# EAGLE design kitchen-timer (EAGLE 7.4.0)
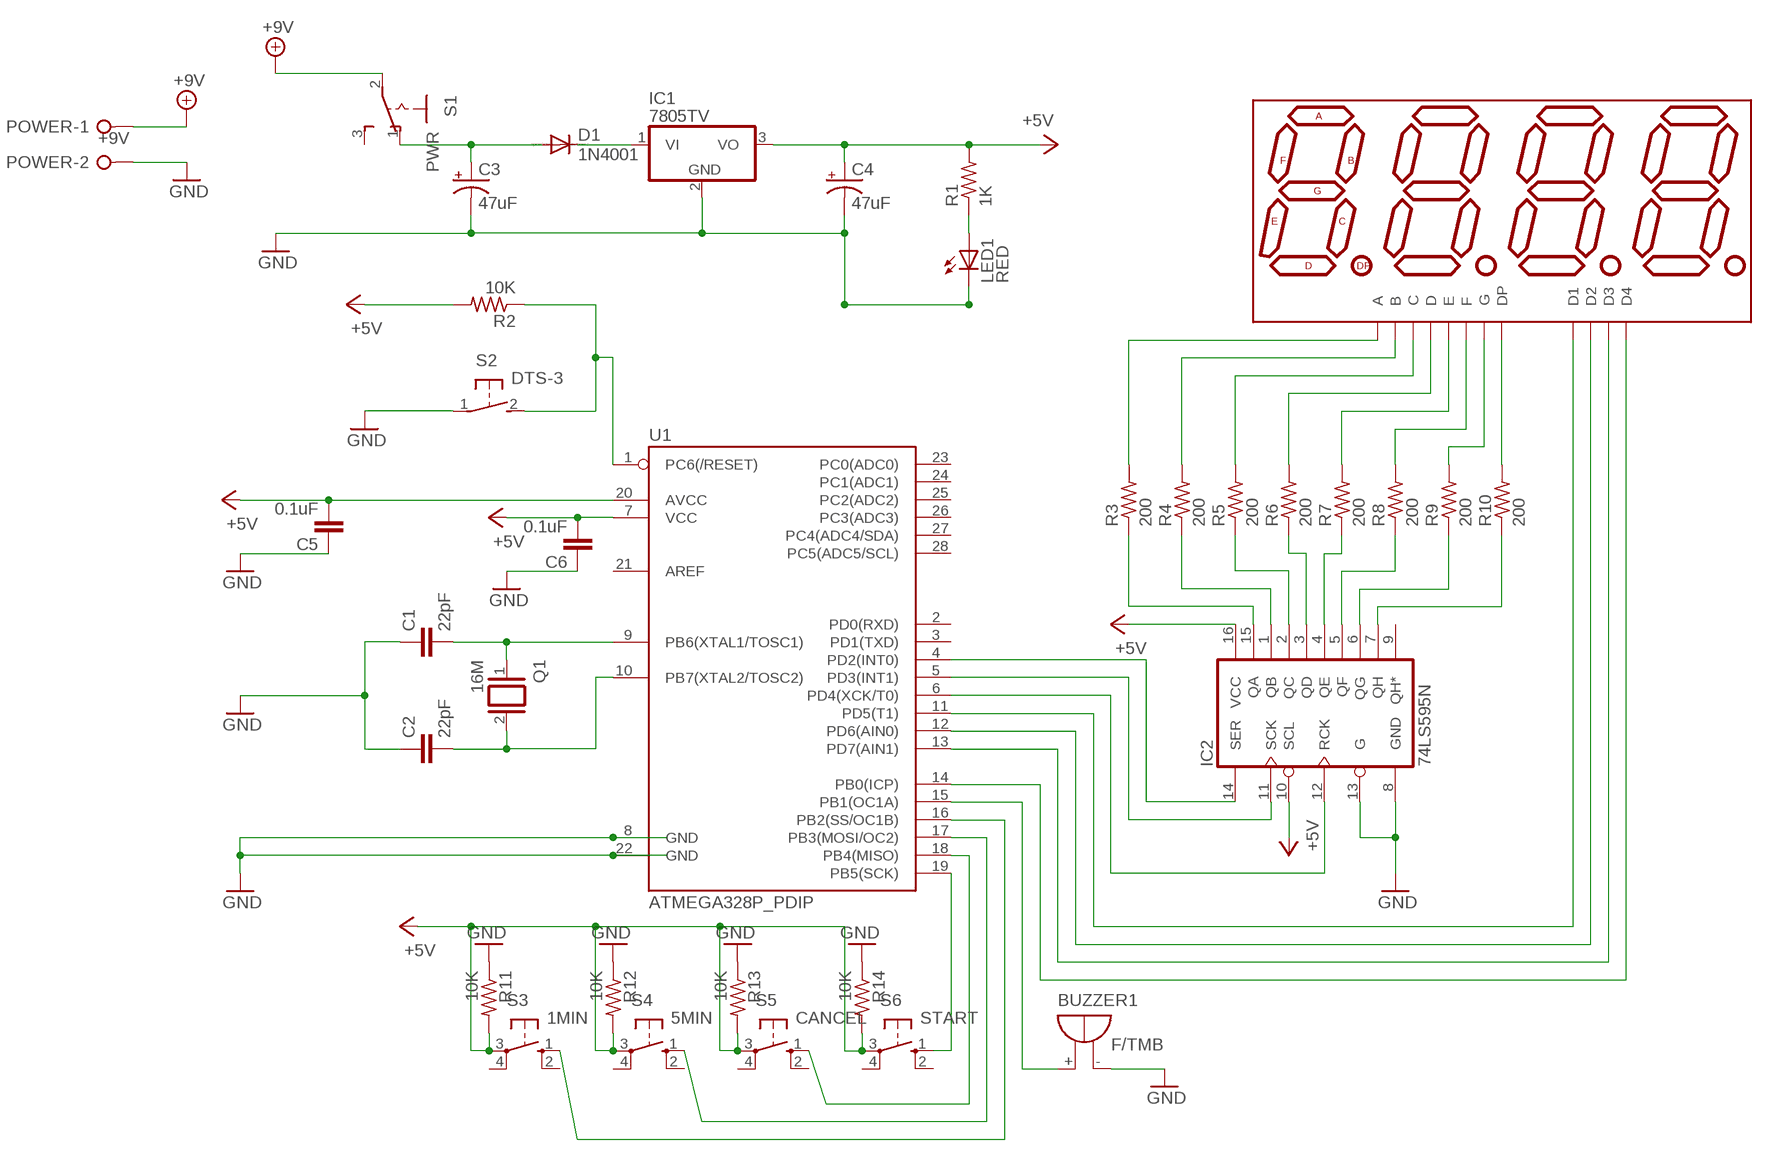
[diagram p0: schematic, sheet 1]

## Parts
BUZZER1  F/TMB  [F/TMB]
C1  22pF  C-EU025-025X050  [C025-025X050]
C2  22pF  C-EU025-025X050  [C025-025X050]
C3  47uF  CPOL-USE2,5-6E  [E2,5-6E]
C4  47uF  CPOL-USE2,5-6E  [E2,5-6E]
C5  0.1uF  C-EU025-025X050  [C025-025X050]
C6  0.1uF  C-EU025-025X050  [C025-025X050]
D1  1N4001  DIODE-D-7.5  [D-7.5]
DISP1  7-SEGMENT-4DIGIT-COUNTER-HP-BUBBLE  [DIL12]
IC1  7805TV  [TO220V]
IC2  74LS595N  [DIL16]
LED1  RED  LED5MM  [LED5MM]
POWER  +9V  W237-02P  [W237-132]
Q1  16M  XTAL/S  [QS]
R1  1K  R-US_0204/7  [0204/7]
R2  10K  R-US_0204/7  [0204/7]
R3  200  R-US_0204/7  [0204/7]
R4  200  R-US_0204/7  [0204/7]
R5  200  R-US_0204/7  [0204/7]
R6  200  R-US_0204/7  [0204/7]
R7  200  R-US_0204/7  [0204/7]
R8  200  R-US_0204/7  [0204/7]
R9  200  R-US_0204/7  [0204/7]
R10  200  R-US_0204/7  [0204/7]
R11  10K  R-US_0204/7  [0204/7]
R12  10K  R-US_0204/7  [0204/7]
R13  10K  R-US_0204/7  [0204/7]
R14  10K  R-US_0204/7  [0204/7]
S1  PWR  255SB  [255SB]
S2  DTS-3  [DTS-3]
S3  1MIN  10-XX  [B3F-10XX]
S4  5MIN  10-XX  [B3F-10XX]
S5  CANCEL  10-XX  [B3F-10XX]
S6  START  10-XX  [B3F-10XX]
U1  ATMEGA328P_PDIP  [DIL28-3]

## Nets
+5V [5v]: C4.+ C5.2 C6.2 IC1.3(VO) IC2.10(SCL) IC2.16(VCC) R1.2 R2.2 R11.2 R12.2 R13.2 R14.2 S3.3(P) S4.3(P) S5.3(P) S6.3(P) U1.7(VCC) U1.20(AVCC)
+9V: POWER.1 S1.2(P)
GND [gnd]: BUZZER1.- C1.1 C2.1 C3.- C4.- C5.1 C6.1 IC1.2(GND) IC2.8(GND) IC2.13(G) LED1.K(C) POWER.2 R11.1 R12.1 R13.1 R14.1 S2.1 U1.8(GND) U1.22(GND)
N$1: C1.2 Q1.1 U1.9(PB6(XTAL1/TOSC1))
N$2 [5v]: C2.2 Q1.2 U1.10(PB7(XTAL2/TOSC2))
N$3: C3.+ D1.A S1.1(O)
N$4: D1.C IC1.1(VI)
N$5: LED1.A R1.1
N$6: R2.1 S2.2 U1.1(PC6(/RESET))
N$7: IC2.15(QA) R3.1
N$8: IC2.1(QB) R4.1
N$9: IC2.2(QC) R5.1
N$10: IC2.3(QD) R6.1
N$11: IC2.4(QE) R7.1
N$12: IC2.5(QF) R8.1
N$13: IC2.6(QG) R9.1
N$14: IC2.7(QH) R10.1
N$15: DISP1.5(DP) R10.2
N$16: DISP1.7(G) R9.2
N$17: DISP1.9(F) R8.2
N$18: DISP1.2(E) R7.2
N$19: DISP1.8(D) R6.2
N$20: DISP1.3(C) R5.2
N$21: DISP1.11(B) R4.2
N$22: DISP1.12(A) R3.2
N$23: IC2.14(SER) U1.4(PD2(INT0))
N$24: IC2.11(SCK) U1.5(PD3(INT1))
N$25: IC2.12(RCK) U1.6(PD4(XCK/T0))
N$26: DISP1.1(D1) U1.11(PD5(T1))
N$27: DISP1.10(D2) U1.12(PD6(AIN0))
N$28: DISP1.4(D3) U1.13(PD7(AIN1))
N$29: DISP1.6(D4) U1.14(PB0(ICP))
N$30: BUZZER1.+ U1.15(PB1(OC1A))
N$31: S6.1(S) U1.19(PB5(SCK))
N$32: S5.1(S) U1.18(PB4(MISO))
N$33: S4.1(S) U1.17(PB3(MOSI/OC2))
N$34: S3.1(S) U1.16(PB2(SS/OC1B))
Unconnected: IC2.9(QH*) S1.3(S) S3.2(S1) S3.4(P1) S4.2(S1) S4.4(P1) S5.2(S1) S5.4(P1) S6.2(S1) S6.4(P1) U1.2(PD0(RXD)) U1.3(PD1(TXD)) U1.21(AREF) U1.23(PC0(ADC0)) U1.24(PC1(ADC1)) U1.25(PC2(ADC2)) U1.26(PC3(ADC3)) U1.27(PC4(ADC4/SDA)) U1.28(PC5(ADC5/SCL))

## Library data of the parts
BUZZER1 = buzzer:F/TMB: BUZZER Source: Buerklin; OC_FARNELL: unknown; OC_NEWARK: unknown
C1 C2 C5 C6 = rcl:C-EU: CAPACITOR, European symbol
C3 C4 = rcl:CPOL-US: POLARIZED CAPACITOR, American symbol
D1 = diode:DIODE-: DIODE
DISP1 = SparkFun-Displays:7-SEGMENT-4DIGIT-COUNTER; STOREFRONT: COM-12710
IC1 = linear:78*: Positive VOLTAGE REGULATOR Source: http://cache.national.com/ds/LM/LM78L05.pdf http://www.fairchildsemi.com/ds/LM/LM7805.pdf
IC2 = SparkFun-DigitalIC:74*595: 8-bit SHIFT REGISTER, output latch
LED1 = led:LED: LED OSRAM: - CHIPLED LG R971, LG N971, LY N971, LG Q971, LY Q971, LO R971, LY R971 LH N974, LH R974 LS Q976, LO Q976, LY Q976 LO Q996 - Hyper CHIPLED LW Q18S LB Q993, LB Q99A, LB R99A - SideLED LS A670, LO A670, LY A670, LG A670, LP A670 LB A673, LV A673, LT A673, LW A673 LH A674 LY A675 LS A676, LA A676, LO A676, LY A676, LW A676 LS A679, LY A679, LG A679 - Hyper Micro SIDELED® LS Y876, LA Y876, LO Y876, LY Y876 LT Y87S - SmartLED LW L88C, LW L88S LB L89C, LB L89S, LG L890 LS L89K, LO L89K, LY L89K LS L896, LA L896, LO L896, LY L896 - TOPLED LS T670, LO T670, LY T670, LG T670, LP T670 LSG T670, LSP T670, LSY T670, LOP T670, LYG T670 LG T671, LOG T671, LSG T671 LB T673, LV T673, LT T673, LW T673 LH T674 LS T676, LA T676, LO T676, LY T676, LB T676, LH T676, LSB T676, LW T676 LB T67C, LV T67C, LT T67C, LS T67K, LO T67K, LY T67K, LW E67C LS E67B, LA E67B, LO E67B, LY E67B, LB E67C, LV E67C, LT E67C LW T67C LS T679, LY T679, LG T679 LS T770, LO T770, LY T770, LG T770, LP T770 LB T773, LV T773, LT T773, LW T773 LH T774 LS E675, LA E675, LY E675, LS T675 LS T776, LA T776, LO T776, LY T776, LB T776 LHGB T686 LT T68C, LB T68C - Hyper Mini TOPLED® LB M676 - Mini TOPLED Santana® LG M470 LS M47K, LO M47K, LY M47K Source: http://www.osram.convergy.de LUXEON: - LUMILED® LXK2-PW12-R00, LXK2-PW12-S00, LXK2-PW14-U00, LXK2-PW14-V00 LXK2-PM12-R00, LXK2-PM12-S00, LXK2-PM14-U00 LXK2-PE12-Q00, LXK2-PE12-R00, LXK2-PE12-S00, LXK2-PE14-T00, LXK2-PE14-U00 LXK2-PB12-K00, LXK2-PB12-L00, LXK2-PB12-M00, LXK2-PB14-N00, LXK2-PB14-P00, LXK2-PB14-Q00 LXK2-PR12-L00, LXK2-PR12-M00, LXK2-PR14-Q00, LXK2-PR14-R00 LXK2-PD12-Q00, LXK2-PD12-R00, LXK2-PD12-S00 LXK2-PH12-R00, LXK2-PH12-S00 LXK2-PL12-P00, LXK2-PL12-Q00, LXK2-PL12-R00 Source: www.luxeon.com KINGBRIGHT: KA-3528ASYC Source: www.kingbright.com
POWER = con-wago-508:W237-02P: WAGO SREW CLAMP; OC_FARNELL: unknown; OC_NEWARK: unknown
Q1 = special:XTAL/S: CRYSTAL
R1-R14 = rcl:R-US_: RESISTOR, American symbol
S1 = switch:255SB: SLIDING SWITCH Distributor Buerklin, 11G810
S2 = switch-tact:DTS-3
S3-S6 = switch-omron:10-XX: OMRON SWITCH; MPN: B3F-1000; OC_FARNELL: 176432; OC_NEWARK: 36M3542
U1 = SparkFun-DigitalIC:ATMEGA328P_PDIP: uC used in the Arduino 32kb flash, 1k EEPROM, 2k SRAM This is the through-hole version of this chip.

## Net classes
1 5v: width 0.61 mm, drill 0.203 mm
2 gnd: width 0.61 mm, drill 0.254 mm

## Board
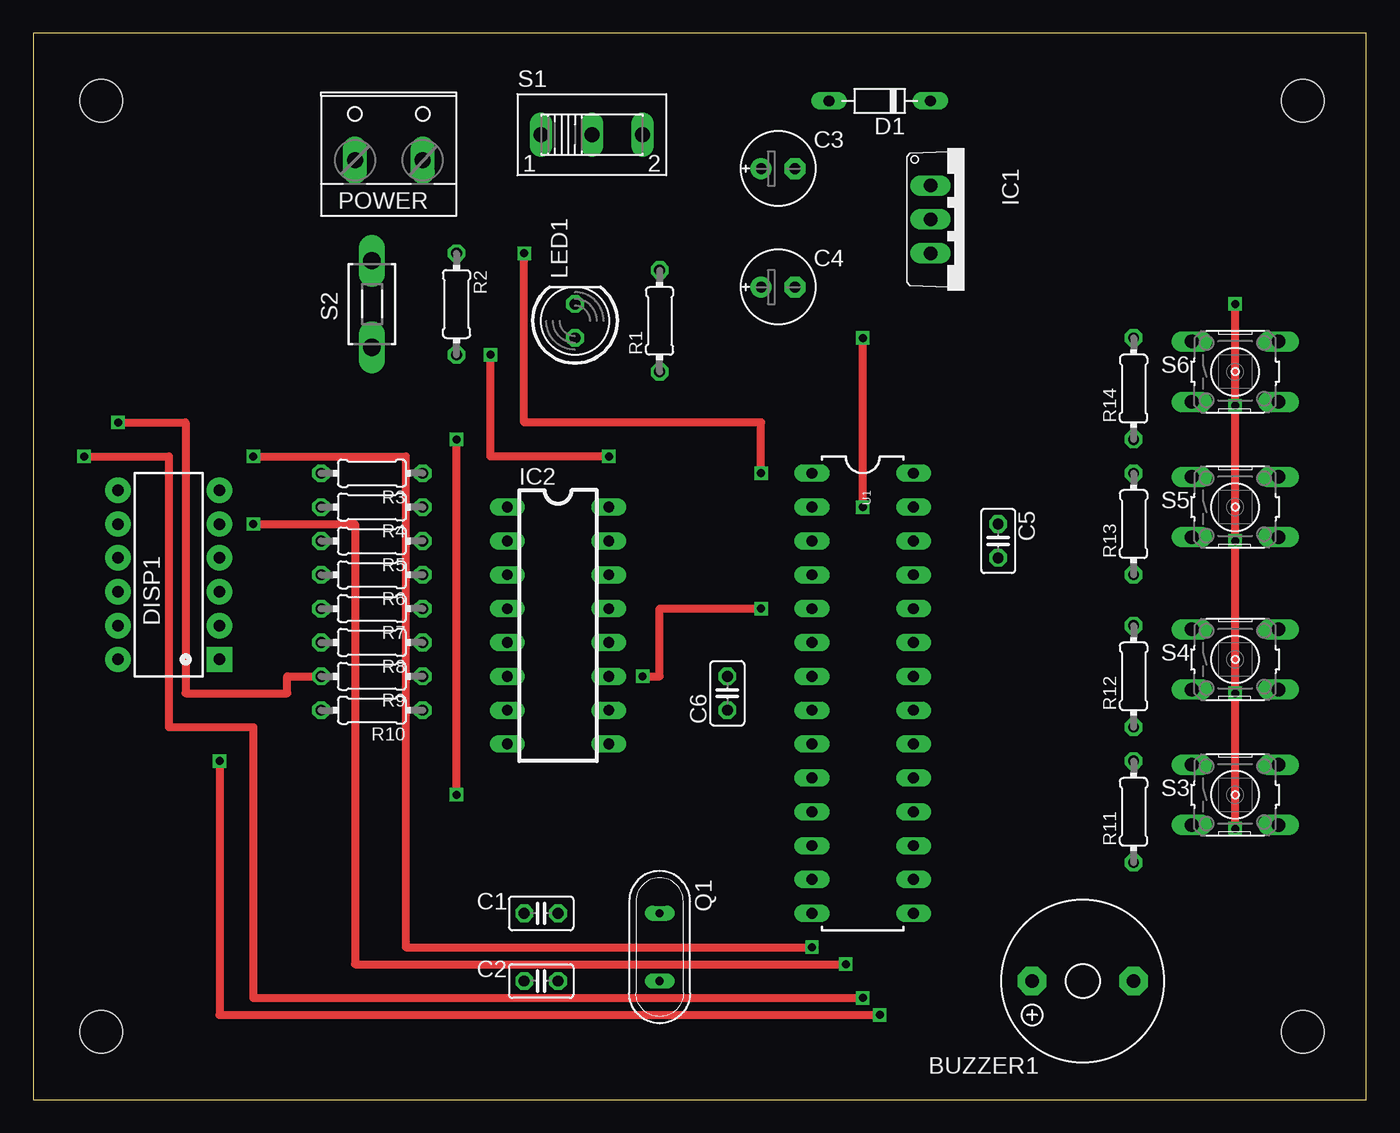
[diagram p1: board, top side]
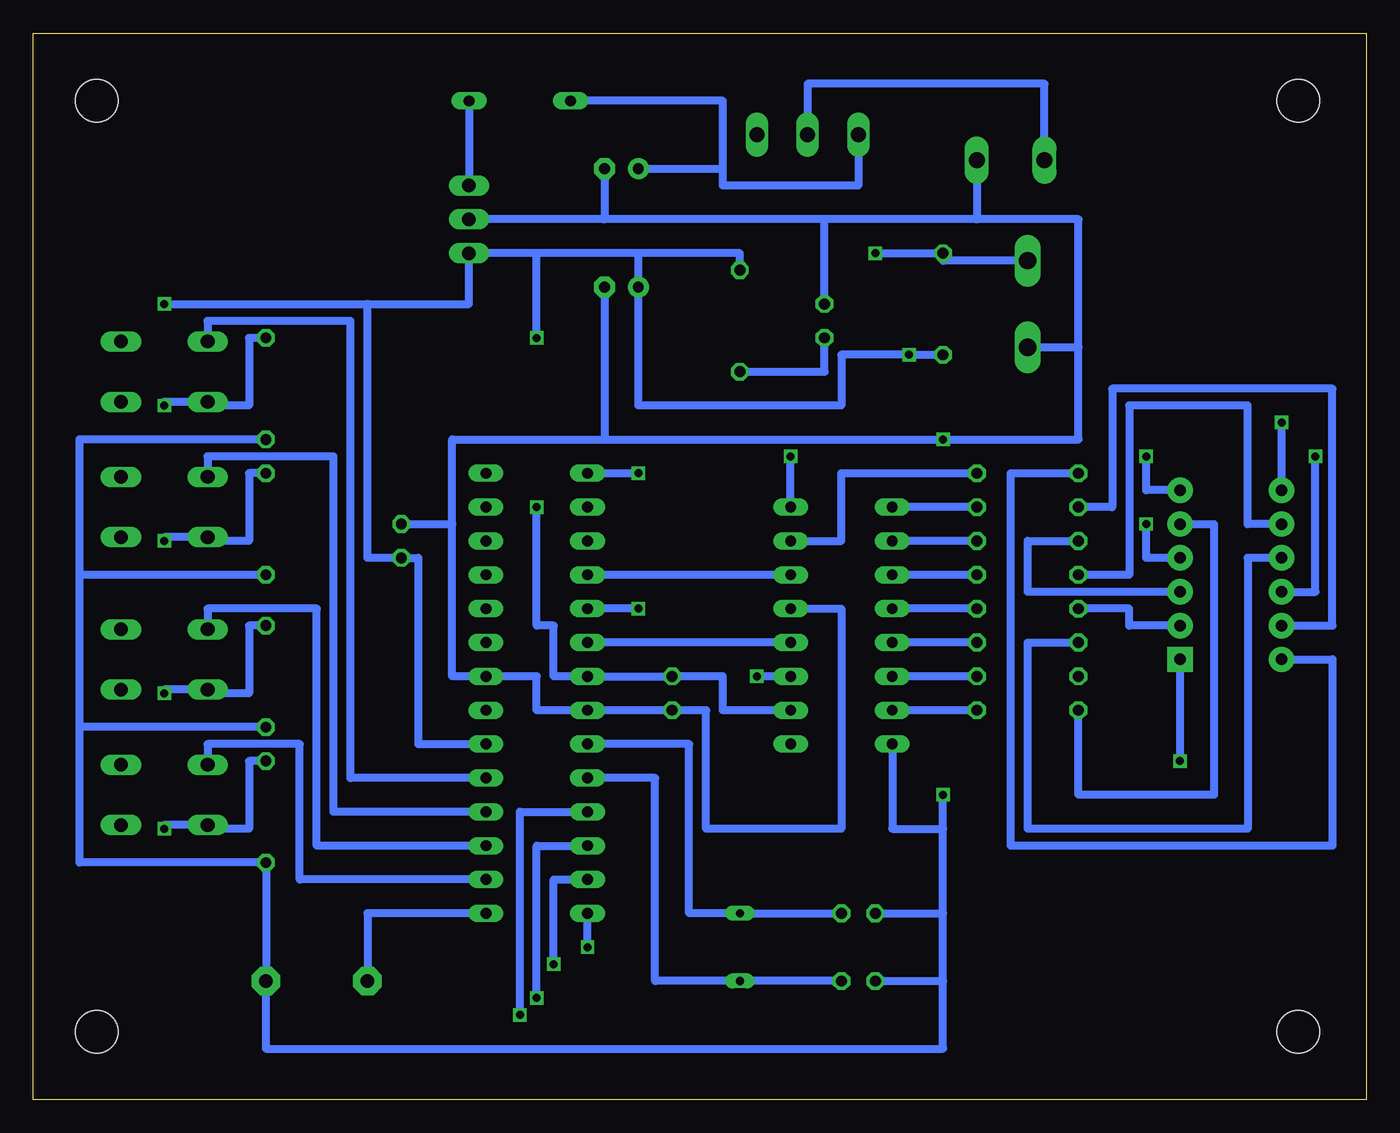
[diagram p2: board, bottom side, seen from below]

Size 100 x 80 mm. Coordinates in mm from the lower left corner, seen from the top.
Outline: 0,0 100,0 100,80 0,80 0,0
Copper layers (1*16): Top 0.035mm / dielectric 1.5mm / Bottom 0.035mm
Design rules "default": minimum track width 10mil, minimum drill 24mil, track to track 8mil, track to pad 8mil, pad to pad 8mil, via to via 8mil, smd to smd 8mil, copper to edge 40mil, drill to drill 8mil, minimum pad ring 10mil, minimum via ring 8mil, stop-mask expansion 4mil, vias tented up to drill 0mil, thermal gap 10mil
Holes 3.2 mm at 5.08,74.93 5.08,5.08 95.25,5.08 95.25,74.93

### Footprints (pad centres in the part's own frame; a part is rotated, then mirrored left to right if it is on the bottom)
F/TMB = drill 1.016 pad 2.159 octagon: + 3.81,0; - -3.81,0
C025-025X050 = drill 0.813 octagon: 1 -1.27,0; 2 1.27,0
E2,5-6E = drill 0.813 pad 1.575: + -1.27,0 | drill 0.813 pad 1.575 octagon: - 1.27,0
D-7.5 = drill 0.813 long: A 3.81,0; C -3.81,0
DIL12 = drill 0.864 pad 1.905 square: 1 -6.35,-3.81 | drill 0.864 pad 1.905: 2 -3.81,-3.81; 3 -1.27,-3.81; 4 1.27,-3.81; 5 3.81,-3.81; 6 6.35,-3.81; 7 6.35,3.81; 8 3.81,3.81; 9 1.27,3.81; 10 -1.27,3.81; 11 -3.81,3.81; 12 -6.35,3.81
TO220V = drill 1.016 long: 1 -2.54,-2.54; 2 0,-2.54; 3 2.54,-2.54
DIL16 = drill 0.813 long: 1 -8.89,-3.81; 2 -6.35,-3.81; 3 -3.81,-3.81; 4 -1.27,-3.81; 5 1.27,-3.81; 6 3.81,-3.81; 7 6.35,-3.81; 8 8.89,-3.81; 9 8.89,3.81; 10 6.35,3.81; 11 3.81,3.81; 12 1.27,3.81; 13 -1.27,3.81; 14 -3.81,3.81; 15 -6.35,3.81; 16 -8.89,3.81
LED5MM = drill 0.813 octagon: A -1.27,0; K 1.27,0
W237-132 = drill 1.194 long: 1 -2.54,-0.635; 2 2.54,-0.635
QS = drill 0.61 long: 1 -2.54,0; 2 2.54,0
0204/7 = drill 0.813 octagon: 1 -3.81,0; 2 3.81,0
255SB = drill 1.118 long: 1 -3.81,0; 2 0,0; 3 3.81,0
DTS-3 = drill 1.3 long: 1 -3.25,0; 2 3.25,0
B3F-10XX = drill 1.016 long: 1 -3.251,2.261; 2 3.251,2.261; 3 -3.251,-2.261; 4 3.251,-2.261
DIL28-3 = drill 0.813 long: 1 -16.51,-3.81; 2 -13.97,-3.81; 3 -11.43,-3.81; 4 -8.89,-3.81; 5 -6.35,-3.81; 6 -3.81,-3.81; 7 -1.27,-3.81; 8 1.27,-3.81; 9 3.81,-3.81; 10 6.35,-3.81; 11 8.89,-3.81; 12 11.43,-3.81; 13 13.97,-3.81; 14 16.51,-3.81; 15 16.51,3.81; 16 13.97,3.81; 17 11.43,3.81; 18 8.89,3.81; 19 6.35,3.81; 20 3.81,3.81; 21 1.27,3.81; 22 -1.27,3.81; 23 -3.81,3.81; 24 -6.35,3.81; 25 -8.89,3.81; 26 -11.43,3.81; 27 -13.97,3.81; 28 -16.51,3.81

### Placement (x,y rotation side)
BUZZER1  78.74,8.89 180 top
C1  38.1,13.97 0 top
C2  38.1,8.89 0 top
C3  55.88,69.85 0 top
C4  55.88,60.96 0 top
C5  72.39,41.91 270 top
C6  52.07,30.48 90 top
D1  63.5,74.93 180 top
DISP1  10.16,39.37 90 top
IC1  69.85,66.04 270 top
IC2  39.37,35.56 270 top
LED1  40.64,58.42 90 top
POWER  26.67,71.12 0 top
Q1  46.99,11.43 270 top
R1  46.99,58.42 90 top
R2  31.75,59.69 270 top
R3  25.4,46.99 180 top
R4  25.4,44.45 180 top
R5  25.4,41.91 180 top
R6  25.4,39.37 180 top
R7  25.4,36.83 180 top
R8  25.4,34.29 180 top
R9  25.4,31.75 180 top
R10  25.4,29.21 180 top
R11  82.55,21.59 90 top
R12  82.55,31.75 90 top
R13  82.55,43.18 90 top
R14  82.55,53.34 90 top
S1  41.91,72.39 0 top
S2  25.4,59.69 90 top
S3  90.17,22.86 0 top
S4  90.17,33.02 0 top
S5  90.17,44.45 0 top
S6  90.17,54.61 0 top
U1  62.23,30.48 270 top

### Tracks (layer width: path | path; a pad name or v marks a point on that pad's centre or on a via)
+5V  (via drill 0.6)
  Top 0.61: v43.18,48.26 34.29,48.26 v34.29,55.88 | v90.17,59.69 v90.17,52.07 v90.17,41.91 v90.17,30.48 v90.17,20.32 | v62.23,44.45 v62.23,57.15
  Bottom 0.61: U1.20 71.12,26.67 71.12,40.64 C5.2 74.93,40.64 74.93,59.69 | IC2.16 v43.18,48.26 | R2.2 v34.29,55.88 39.37,55.88 39.37,52.07 54.61,52.07 C4.+ 54.61,63.5 | R1.2 46.99,63.5 54.61,63.5 | 54.61,63.5 62.23,63.5 | 62.23,63.5 IC1.3 67.31,59.69 74.93,59.69 | IC2.10 48.26,29.21 48.26,31.75 C6.2 U1.7 60.96,31.75 60.96,35.56 62.23,35.56 v62.23,44.45 | v90.17,52.07 90.17,52.35 S6.3 86.92,52.07 83.82,52.07 83.82,57.15 R14.2 | v90.17,59.69 74.93,59.69 | v90.17,30.48 90.17,30.76 S4.3 86.92,30.48 83.82,30.48 83.82,35.56 R12.2 | v90.17,20.32 90.17,20.6 S3.3 86.92,20.32 83.82,20.32 83.82,25.4 R11.2 | v62.23,57.15 62.23,63.5 | R13.2 83.82,46.99 83.82,41.91 86.92,41.91 S5.3 90.17,42.19 v90.17,41.91
+9V
  Bottom 0.61: POWER.1 24.13,76.2 41.91,76.2 S1.2
GND  (via drill 0.6)
  Top 0.61: v31.75,22.86 v31.75,49.53
  Bottom 0.61: POWER.2 29.21,66.04 | 29.21,66.04 40.64,66.04 | 40.64,66.04 57.15,66.04 | 57.15,66.04 IC1.2 | C3.- 57.15,66.04 | LED1.K 40.64,66.04 | S2.1 21.59,56.44 | 21.59,56.44 21.59,66.04 29.21,66.04 | C2.1 31.75,8.89 | 31.75,8.89 31.75,13.97 | 31.75,13.97 31.75,20.32 | 31.75,20.32 v31.75,22.86 | 21.59,56.44 21.59,49.53 v31.75,49.53 57.15,49.53 | C1.1 31.75,13.97 | IC2.8 35.56,20.32 31.75,20.32 | 31.75,8.89 31.75,3.81 82.55,3.81 BUZZER1.- R11.1 96.52,17.78 96.52,27.94 | 96.52,27.94 96.52,39.37 | 96.52,39.37 96.52,49.53 R14.1 | R13.1 96.52,39.37 | R12.1 96.52,27.94 | C5.1 68.58,43.18 | 68.58,43.18 68.58,49.53 57.15,49.53 | 68.58,43.18 68.58,31.75 U1.22 62.23,31.75 62.23,29.21 U1.8 C6.1 49.53,29.21 49.53,20.32 39.37,20.32 39.37,36.83 IC2.13 | C4.- 57.15,49.53
N$1
  Bottom 0.61: U1.9 50.8,26.67 50.8,13.97 Q1.1 C1.2
N$2
  Bottom 0.61: Q1.2 C2.2 53.34,8.89 53.34,24.13 U1.10
N$3
  Bottom 0.61: S1.1 38.1,68.58 48.26,68.58 48.26,69.85 | 48.26,69.85 48.26,74.93 D1.A | C3.+ 48.26,69.85
N$4
  Bottom 0.61: D1.C IC1.1
N$5
  Bottom 0.61: R1.1 40.64,54.61 LED1.A
N$6  (via drill 0.6)
  Top 0.61: v54.61,46.99 54.61,50.8 36.83,50.8 v36.83,63.5
  Bottom 0.61: S2.2 31.75,62.94 R2.1 v36.83,63.5 | U1.1 v54.61,46.99
N$7
  Bottom 0.61: IC2.15 39.37,41.91 39.37,46.99 R3.1
N$8
  Bottom 0.61: R4.1 IC2.1
N$9
  Bottom 0.61: R5.1 IC2.2
N$10
  Bottom 0.61: R6.1 IC2.3
N$11
  Bottom 0.61: R7.1 IC2.4
N$12
  Bottom 0.61: R8.1 IC2.5
N$13
  Bottom 0.61: R9.1 IC2.6
N$14
  Bottom 0.61: R10.1 IC2.7
N$15
  Bottom 0.61: DISP1.5 11.43,43.18 11.43,22.86 21.59,22.86 R10.2
N$16  (via drill 0.6)
  Top 0.61: v6.35,50.8 11.43,50.8 11.43,30.48 19.05,30.48 19.05,31.75 R9.2
  Bottom 0.61: DISP1.7 v6.35,50.8
N$17
  Bottom 0.61: DISP1.9 8.89,40.64 8.89,20.32 25.4,20.32 25.4,34.29 R8.2
N$18
  Bottom 0.61: DISP1.2 17.78,35.56 17.78,36.83 R7.2
N$19
  Bottom 0.61: DISP1.8 8.89,43.18 8.89,52.07 17.78,52.07 17.78,39.37 R6.2
N$20
  Bottom 0.61: DISP1.3 25.4,38.1 25.4,41.91 R5.2
N$21
  Bottom 0.61: DISP1.11 2.54,35.56 2.54,53.34 19.05,53.34 19.05,44.45 R4.2
N$22
  Bottom 0.61: DISP1.12 2.54,33.02 2.54,19.05 26.67,19.05 26.67,46.99 R3.2
N$23
  Bottom 0.61: IC2.14 U1.4
N$24  (via drill 0.6)
  Top 0.61: v45.72,31.75 46.99,31.75 46.99,36.83 v54.61,36.83
  Bottom 0.61: IC2.11 v45.72,31.75 | v54.61,36.83 U1.5
N$25
  Bottom 0.61: IC2.12 U1.6
N$26  (via drill 0.6)
  Top 0.61: v13.97,25.4 13.97,6.35 v63.5,6.35
  Bottom 0.61: DISP1.1 v13.97,25.4 | v63.5,6.35 63.5,21.59 U1.11
N$27  (via drill 0.6)
  Top 0.61: v3.81,48.26 10.16,48.26 10.16,27.94 16.51,27.94 16.51,7.62 v62.23,7.62
  Bottom 0.61: DISP1.10 3.81,38.1 v3.81,48.26 | v62.23,7.62 62.23,19.05 U1.12
N$28  (via drill 0.6)
  Top 0.61: v16.51,43.18 24.13,43.18 24.13,10.16 v60.96,10.16
  Bottom 0.61: DISP1.4 16.51,40.64 v16.51,43.18 | v60.96,10.16 60.96,16.51 U1.13
N$29  (via drill 0.6)
  Top 0.61: v16.51,48.26 27.94,48.26 27.94,11.43 v58.42,11.43
  Bottom 0.61: DISP1.6 16.51,45.72 v16.51,48.26 | v58.42,11.43 U1.14
N$30
  Bottom 0.61: U1.15 74.93,13.97 BUZZER1.+
N$31
  Bottom 0.61: U1.19 76.2,24.13 76.2,58.42 86.92,58.42 S6.1
N$32
  Bottom 0.61: U1.18 77.47,21.59 77.47,48.26 86.92,48.26 S5.1
N$33
  Bottom 0.61: U1.17 78.74,19.05 78.74,36.83 86.92,36.83 S4.1
N$34
  Bottom 0.61: U1.16 80.01,16.51 80.01,26.67 86.92,26.67 S3.1